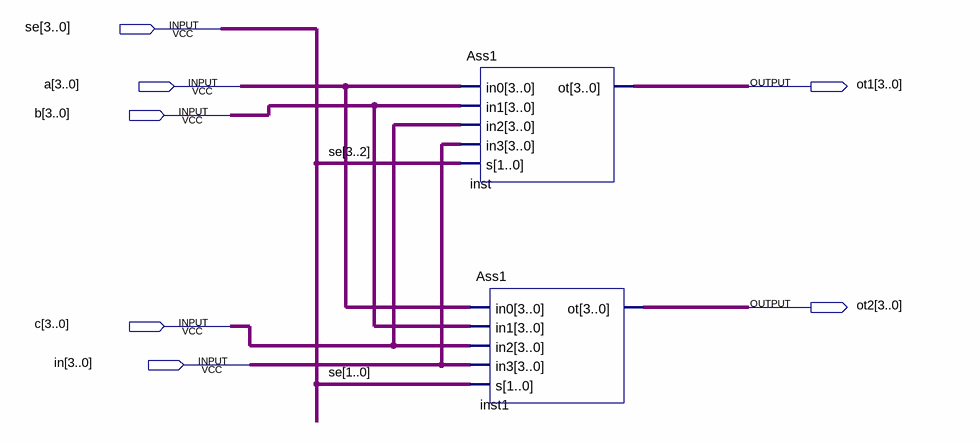
[diagram p0: schematic sheet]
// Quartus schematic SourDest.bdf as structural Verilog: 2 symbols, 7 pins
module SourDest (
  input  [3:0] se,
  input  [3:0] a,
  input  [3:0] b,
  input  [3:0] c,
  input  [3:0] in,
  output [3:0] ot1,
  output [3:0] ot2
);

  Ass1 inst (.in0(a), .in1(b), .in2(c), .in3(in), .s(se[3:2]), .ot(ot1));
  Ass1 inst1 (.in0(a), .in1(b), .in2(c), .in3(in), .s(se[1:0]), .ot(ot2));
endmodule
